# Altium schematic sheet schematic 1 .SchDoc
size A3; SheetNumber: 1; SheetTotal: 1
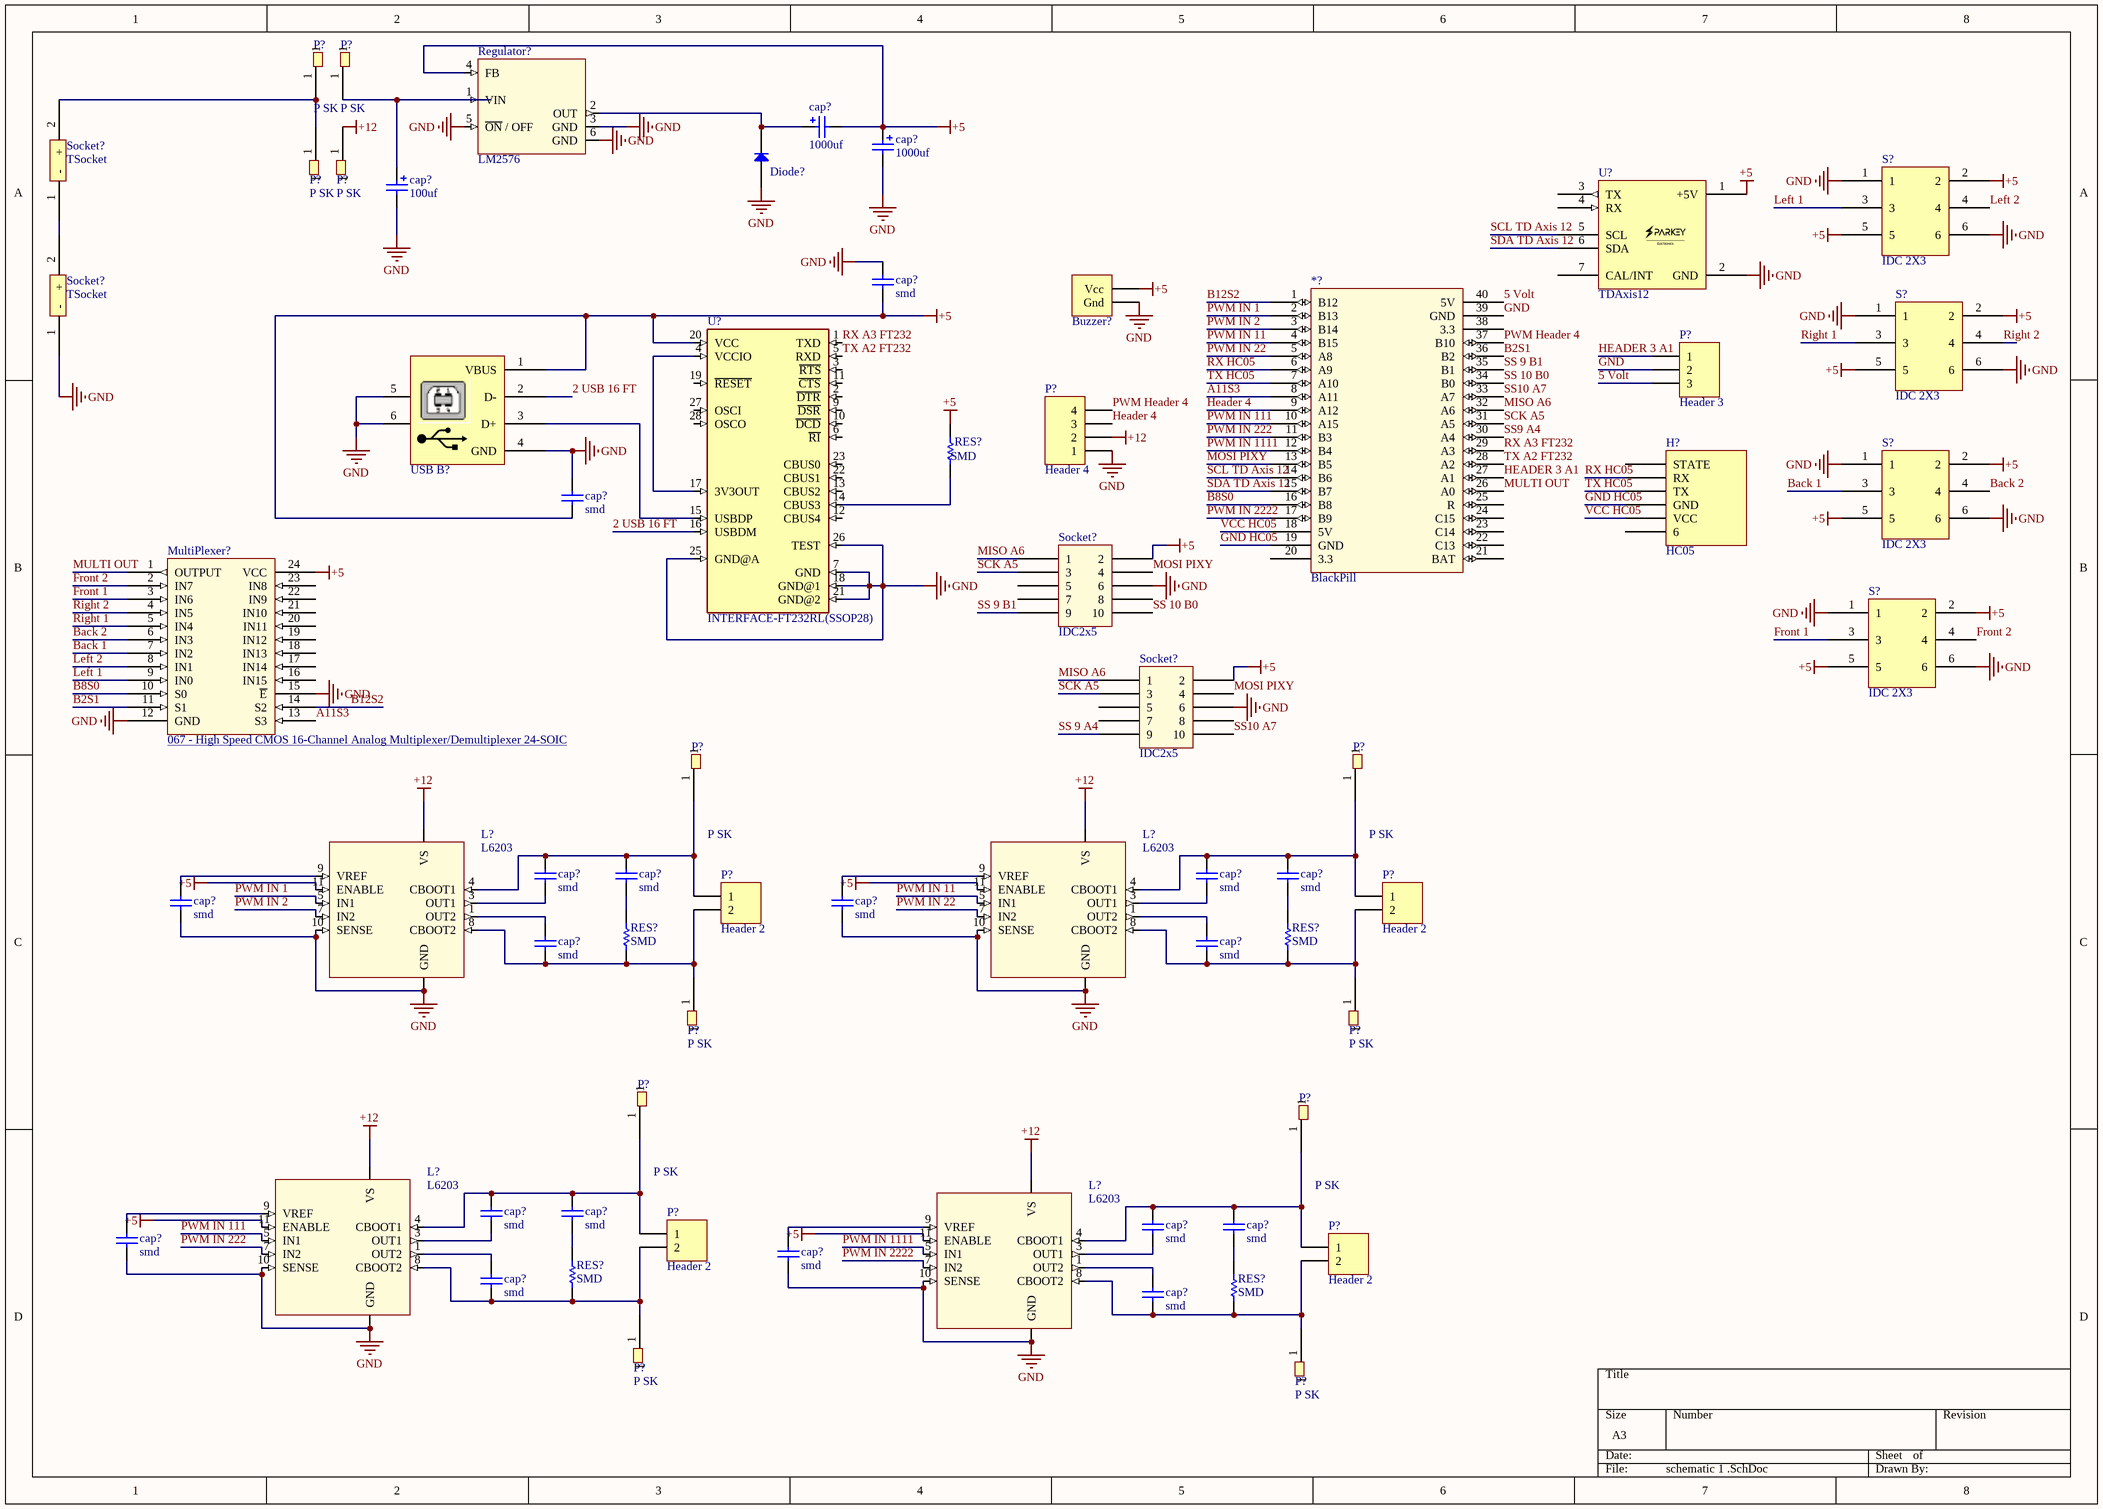
[diagram p0: schematic 1 .SchDoc]

## Parts
(Parts that share a designator on the sheet are numbered #1, #2 ... from top to bottom, then left to right.)
*?  BlackPill  [BlackPill]
Buzzer?  Buzzer  [Buzzer]  (value not drawn)
cap?#1  1000uf  [Cap 1000uf]
cap?#2  1000uf  [Cap 1000uf]
cap?#3  100uf  [Cap 100uF]
cap?#4  smd  [Cap SMD]
cap?#5  smd  [Cap SMD]
cap?#6  smd  [Cap SMD]
cap?#7  smd  [Cap SMD]
cap?#8  smd  [Cap SMD]
cap?#9  smd  [Cap SMD]
cap?#10  smd  [Cap SMD]
cap?#11  smd  [Cap SMD]
cap?#12  smd  [Cap SMD]
cap?#13  smd  [Cap SMD]
cap?#14  smd  [Cap SMD]
cap?#15  smd  [Cap SMD]
cap?#16  smd  [Cap SMD]
cap?#17  smd  [Cap SMD]
cap?#18  smd  [Cap SMD]
cap?#19  smd  [Cap SMD]
cap?#20  smd  [Cap SMD]
cap?#21  smd  [Cap SMD]
Diode?  Diode  [Diode]  (value not drawn)
H?  HC05  [HC05]
L?#1  L6203  [MultiWatt11]
L?#2  L6203  [MultiWatt11]
L?#3  L6203  [MultiWatt11]
L?#4  L6203  [MultiWatt11]
MultiPlexer?  067 - High Speed CMOS 16-Channel Analog Multiplexer/Demultiplexer 24-SOIC  [SOIC24]
P?#1  P SK  [P SK]
P?#2  P SK  [P SK]
P?#3  P SK  [P SK]
P?#4  P SK  [P SK]
P?#5  Header 3  [HDR1X3]
P?#6  Header 4  [HDR1X4]
P?#7  P SK  [P SK]
P?#8  P SK  [P SK]
P?#9  Header 2  [HDR1X2]
P?#10  Header 2  [HDR1X2]
P?#11  P SK  [P SK]
P?#12  P SK  [P SK]
P?#13  P SK  [P SK]
P?#14  P SK  [P SK]
P?#15  Header 2  [HDR1X2]
P?#16  Header 2  [HDR1X2]
P?#17  P SK  [P SK]
P?#18  P SK  [P SK]
Regulator?  LM2576  [D2PAK]
RES?#1  SMD  [Resistor SMD 1206]
RES?#2  SMD  [Resistor SMD 1206]
RES?#3  SMD  [Resistor SMD 1206]
RES?#4  SMD  [Resistor SMD 1206]
RES?#5  SMD  [Resistor SMD 1206]
S?#1  IDC 2X3  [IDC 2X3]
S?#2  IDC 2X3  [IDC 2X3]
S?#3  IDC 2X3  [IDC 2X3]
S?#4  IDC 2X3  [IDC 2X3]
Socket?#1  TSocket  [TSocket]
Socket?#2  TSocket  [TSocket]
Socket?#3  IDC2x5  [IDC 2x5]
Socket?#4  IDC2x5  [IDC 2x5]
U?#1  TDAxis12  [TDAxis12]
U?#2  INTERFACE-FT232RL(SSOP28)  [SSOP28-0.65-10.2X5.2MM]
USB_B?  USB_B  [USB_B.1]  (value not drawn)

## Nets
+5: Buzzer?.1(Vcc) cap?#1.2 cap?#2.1 cap?#4.1 cap?#5.1 L?#1.11(ENABLE) L?#2.11(ENABLE) L?#3.11(ENABLE) L?#4.11(ENABLE) MultiPlexer?.24(VCC) Regulator?.4(FB) RES?#1.2 S?#1.2 S?#1.5 S?#2.2 S?#2.5 S?#3.2 S?#3.5 S?#4.2 S?#4.5 Socket?#3.2 Socket?#4.2 U?#1.1(+5V) U?#2.20(VCC) USB_B?.1(VBUS)
+12: L?#1.2(VS) L?#2.2(VS) L?#3.2(VS) L?#4.2(VS) P?#4.1 P?#6.2
GND: *?.39(GND) Buzzer?.2(Gnd) cap?#2.2 cap?#3.2 cap?#4.2 cap?#5.2 cap?#10.1 cap?#11.1 cap?#18.1 cap?#19.1 Diode?.1(A) L?#1.6(GND) L?#1.10(SENSE) L?#2.6(GND) L?#2.10(SENSE) L?#3.6(GND) L?#3.10(SENSE) L?#4.6(GND) L?#4.10(SENSE) MultiPlexer?.12(GND) MultiPlexer?.15(~{E}) P?#5.2 P?#6.1 Regulator?.3(GND) Regulator?.5(~{ON}_/_OFF) Regulator?.6(GND) S?#1.1 S?#1.6 S?#2.1 S?#2.6 S?#3.1 S?#3.6 S?#4.1 S?#4.6 Socket?#2.1(-) Socket?#3.6 Socket?#4.6 U?#1.2(GND) U?#2.7(GND) U?#2.18(GND@1) U?#2.21(GND@2) U?#2.25(GND@A) U?#2.26(TEST) USB_B?.4(GND) USB_B?.5 USB_B?.6
2 USB 16 FT: U?#2.16(USBDM) USB_B?.2(D-)
5 Volt: *?.40(5V) P?#5.3
A11S3: *?.8(A11) MultiPlexer?.13(S3)
B2S1: *?.36(B2) MultiPlexer?.11(S1)
B8S0: *?.16(B8) MultiPlexer?.10(S0)
B12S2: *?.1(B12) MultiPlexer?.14(S2)
Back 1: MultiPlexer?.7(IN2) S?#3.3
Back 2: MultiPlexer?.6(IN3) S?#3.4
Front 1: MultiPlexer?.3(IN6) S?#4.3
Front 2: MultiPlexer?.2(IN7) S?#4.4
GND HC05: *?.19(GND) H?.4(GND)
HEADER 3 A1: *?.27(A1) P?#5.1
Header 4: *?.9(A12) P?#6.3
Left 1: MultiPlexer?.9(IN0) S?#1.3
Left 2: MultiPlexer?.8(IN1) S?#1.4
MISO A6: *?.32(A6) Socket?#3.1 Socket?#4.1
MOSI PIXY: *?.13(B5) Socket?#3.4 Socket?#4.4
MULTI OUT: *?.26(A0) MultiPlexer?.1(OUTPUT)
PWM Header 4: *?.37(B10) P?#6.4
PWM IN 1: *?.2(B13) L?#1.5(IN1)
PWM IN 2: *?.3(B14) L?#1.7(IN2)
PWM IN 11: *?.4(B15) L?#2.5(IN1)
PWM IN 22: *?.5(A8) L?#2.7(IN2)
PWM IN 111: *?.10(A15) L?#3.5(IN1)
PWM IN 222: *?.11(B3) L?#3.7(IN2)
PWM IN 1111: *?.12(B4) L?#4.5(IN1)
PWM IN 2222: *?.17(B9) L?#4.7(IN2)
Right 1: MultiPlexer?.5(IN4) S?#2.3
Right 2: MultiPlexer?.4(IN5) S?#2.4
RX A3 FT232: *?.29(A3) U?#2.1(TXD)
RX HC05: *?.6(A9) H?.2(RX)
SCK A5: *?.31(A5) Socket?#3.3 Socket?#4.3
SCL TD Axis 12: *?.14(B6) U?#1.5(SCL)
SDA TD Axis 12: *?.15(B7) U?#1.6(SDA)
SS9 A4: *?.30(A4)
SS10 A7: *?.33(A7) Socket?#4.10
SS 9 A4: Socket?#4.9
SS 9 B1: *?.35(B1) Socket?#3.9
SS 10 B0: *?.34(B0) Socket?#3.10
TX A2 FT232: *?.28(A2) U?#2.5(RXD)
TX HC05: *?.7(A10) H?.3(TX)
VCC HC05: *?.18(5V) H?.5(VCC)
Netcap?#1_1: cap?#1.1 Diode?.2(K) Regulator?.2(OUT)
Netcap?#3_1: cap?#3.1 P?#2.1 Regulator?.1(VIN)
Netcap?#6_1: cap?#6.1 L?#1.3(OUT1)
Netcap?#6_2: cap?#6.2 cap?#7.2 L?#1.4(CBOOT1) P?#7.1 P?#9.1
Netcap?#7_1: cap?#7.1 RES?#2.2
Netcap?#8_1: cap?#8.1 L?#2.3(OUT1)
Netcap?#8_2: cap?#8.2 cap?#9.2 L?#2.4(CBOOT1) P?#8.1 P?#10.1
Netcap?#9_1: cap?#9.1 RES?#3.2
Netcap?#10_2: cap?#10.2 L?#1.9(VREF)
Netcap?#11_2: cap?#11.2 L?#2.9(VREF)
Netcap?#12_1: cap?#12.1 L?#1.8(CBOOT2) P?#9.2 P?#11.1 RES?#2.1
Netcap?#12_2: cap?#12.2 L?#1.1(OUT2)
Netcap?#13_1: cap?#13.1 L?#2.8(CBOOT2) P?#10.2 P?#12.1 RES?#3.1
Netcap?#13_2: cap?#13.2 L?#2.1(OUT2)
Netcap?#14_1: cap?#14.1 L?#3.3(OUT1)
Netcap?#14_2: cap?#14.2 cap?#15.2 L?#3.4(CBOOT1) P?#13.1 P?#15.1
Netcap?#15_1: cap?#15.1 RES?#4.2
Netcap?#16_1: cap?#16.1 L?#4.3(OUT1)
Netcap?#16_2: cap?#16.2 cap?#17.2 L?#4.4(CBOOT1) P?#14.1 P?#16.1
Netcap?#17_1: cap?#17.1 RES?#5.2
Netcap?#18_2: cap?#18.2 L?#3.9(VREF)
Netcap?#19_2: cap?#19.2 L?#4.9(VREF)
Netcap?#20_1: cap?#20.1 L?#3.8(CBOOT2) P?#15.2 P?#17.1 RES?#4.1
Netcap?#20_2: cap?#20.2 L?#3.1(OUT2)
Netcap?#21_1: cap?#21.1 L?#4.8(CBOOT2) P?#16.2 P?#18.1 RES?#5.1
Netcap?#21_2: cap?#21.2 L?#4.1(OUT2)
NetP?#1_1: P?#1.1 P?#3.1 Socket?#1.2(+)
NetRES?#1_1: RES?#1.1 U?#2.14(CBUS3)
NetSocket?#1_1: Socket?#1.1(-) Socket?#2.2(+)
NetU?#2_4: U?#2.4(VCCIO) U?#2.17(3V3OUT)
NetU?#2_15: U?#2.15(USBDP) USB_B?.3(D+)

Not connected (* = marked no-connect by the designer): *? 20(3.3) 21(BAT) 22(C13) 23(C14) 24(C15) 25(R) 38(3.3); H? 1(STATE) 6; MultiPlexer? 16(IN15) 17(IN14) 18(IN13) 19(IN12) 20(IN11) 21(IN10) 22(IN9) 23(IN8); Socket?#3 5 7 8; Socket?#4 5 7 8; U?#1 3(TX) 4(RX) 7(CAL/INT); U?#2 2(~{DTR}) 3(~{RTS}) 6(~{RI}) 9(~{DSR}) 10(~{DCD}) 11(~{CTS}) 12(CBUS4) 13(CBUS2) 19(~{RESET}) 22(CBUS1) 23(CBUS0) 27(OSCI) 28(OSCO)

## Library data of the parts
cap?#1 cap?#2 = Cap 1000uF
cap?#3 = Cap 100uF
cap?#4-cap?#21 = Cap SMD
MultiPlexer? = 74HC4067: By: @JavadRah; Publisher: Prim.ir
P?#5 = Header 3: Header, 3-Pin; LatestRevisionDate: 17-Jul-2002; LatestRevisionNote: Re-released for DXP Platform.; Publisher: Altium Limited
P?#6 = Header 4: Header, 4-Pin; LatestRevisionDate: 17-Jul-2002; LatestRevisionNote: Re-released for DXP Platform.; Publisher: Altium Limited
P?#9 P?#10 P?#15 P?#16 = Header 2: Header, 2-Pin; LatestRevisionDate: 17-Jul-2002; LatestRevisionNote: Re-released for DXP Platform.; Publisher: Altium Limited
RES?#1-RES?#5 = Res SMD
Socket?#3 Socket?#4 = IDC 2x5
U?#1 = TDAxis12: Module, 12 Axis IMU, I2C UART Output
U?#2 = INTERFACE-FT232RL(SSOP28): USB Bridge, USB to UART USB 2.0 UART Interface 28-SSOP; MF: FTDI, Future; SnapEDA_Link: https://www.snapeda.com/parts/FT232RL/FTDI%252C+Future+Technology+Devices+International+Ltd/view-part/?ref=snap; Package: SSOP-28 FTDI; Value: *; MP: FT232RL; Check_prices: https://www.snapeda.com/parts/FT232RL/FTDI%252C+Future+Technology+Devices+International+Ltd/view-part/?ref=eda
USB_B? = USB_B: USB B; LatestRevisionDate: 17-Jul-2002; LatestRevisionNote: Re-released for DXP Platform.; Publisher: Altium Limited